# Altium project EmSys_K70Wn_v1.PrjPCB (part 3 of 3)

## Sheet Sheet6.SchDoc
size A3; DocumentNumber: 6; SheetNumber: 6; SheetTotal: 7
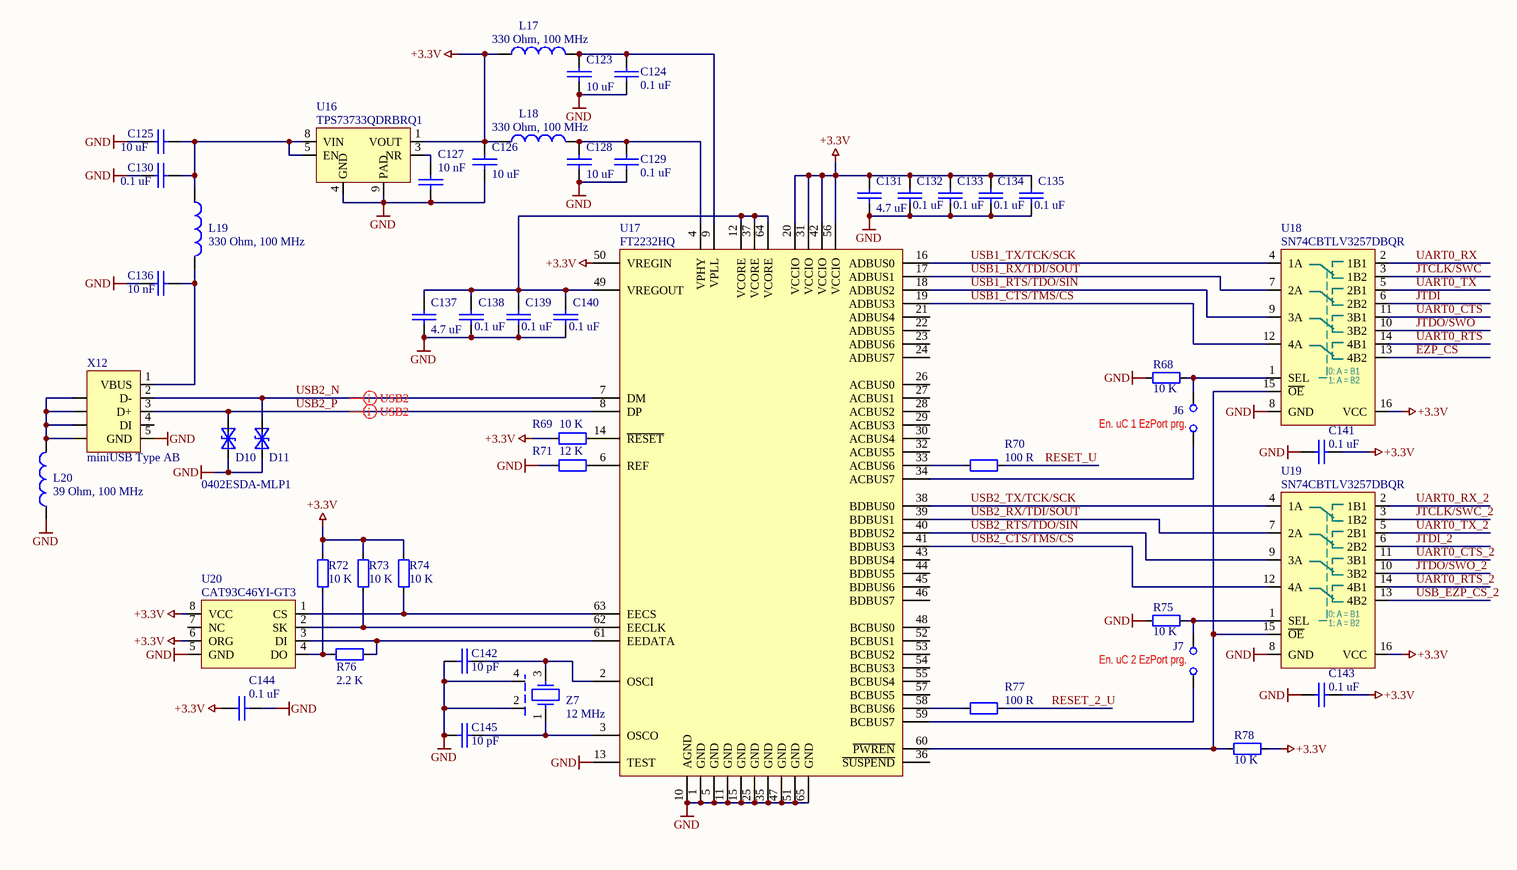
[diagram p5: Sheet6.SchDoc]

### Parts
C123  value 10 uF  [2012[0805]]  (hidden comment: C2012X5R1C106K085AC)
C124  value 0.1 uF  [1005[0402]]  (hidden comment: CL10B104KA8NNND)
C125  value 10 uF  [2012[0805]]  (hidden comment: C2012X5R1C106K085AC)
C126  value 10 uF  [2012[0805]]  (hidden comment: C2012X5R1C106K085AC)
C127  value 10 nF  [1005[0402]]  (hidden comment: CL05B103KB5NNNC)
C128  value 10 uF  [2012[0805]]  (hidden comment: C2012X5R1C106K085AC)
C129  value 0.1 uF  [1005[0402]]  (hidden comment: CL10B104KA8NNND)
C130  value 0.1 uF  [1608[0603]]  (hidden comment: CL10B104KA8NNND)
C131  value 4.7 uF  [1608[0603]]  (hidden comment: LMK107BJ475KA-T)
C132  value 0.1 uF  [1005[0402]]  (hidden comment: CL10B104KA8NNND)
C133  value 0.1 uF  [1005[0402]]  (hidden comment: CL10B104KA8NNND)
C134  value 0.1 uF  [1005[0402]]  (hidden comment: CL10B104KA8NNND)
C135  value 0.1 uF  [1005[0402]]  (hidden comment: CL10B104KA8NNND)
C136  value 10 nF  [1608[0603]]  (hidden comment: CL10B103JB8NNNC)
C137  value 4.7 uF  [1608[0603]]  (hidden comment: LMK107BJ475KA-T)
C138  value 0.1 uF  [1005[0402]]  (hidden comment: CL10B104KA8NNND)
C139  value 0.1 uF  [1005[0402]]  (hidden comment: CL10B104KA8NNND)
C140  value 0.1 uF  [1005[0402]]  (hidden comment: CL10B104KA8NNND)
C141  value 0.1 uF  [1005[0402]]  (hidden comment: CL10B104KA8NNND)
C142  value 10 pF  [1608[0603]]  (hidden comment: CCPF010K0603)
C143  value 0.1 uF  [1005[0402]]  (hidden comment: CL10B104KA8NNND)
C144  value 0.1 uF  [1005[0402]]  (hidden comment: CL10B104KA8NNND)
C145  value 10 pF  [1608[0603]]  (hidden comment: CCPF010K0603)
D10  0402ESDA-MLP1  [0402]  (value not drawn)
D11  0402ESDA-MLP1  [0402]
J6  PH1-02-TA-HT  [HDR1X2V]  (value not drawn)
J7  PH1-02-TA-HT  [HDR1X2V]  (value not drawn)
L17  value 330 Ohm, 100 MHz  [0603]  (hidden comment: BLM18SG331TN1D)
L18  value 330 Ohm, 100 MHz  [0603]  (hidden comment: BLM18SG331TN1D)
L19  value 330 Ohm, 100 MHz  [0603]  (hidden comment: BLM18SG331TN1D)
L20  value 39 Ohm, 100 MHz  [0805]  (hidden comment: EXC-ML20A390U)
R68  value 10 K  [0603]  (hidden comment: ERJ-3EKF1002V)
R69  value 10 K  [0603]  (hidden comment: ERJ-3EKF1002V)
R70  value 100 R  [0603]  (hidden comment: ERJ-3EKF1000V)
R71  value 12 K  [0603]  (hidden comment: RC0603FR-0712KL)
R72  value 10 K  [0603]  (hidden comment: ERJ-3EKF1002V)
R73  value 10 K  [0603]  (hidden comment: ERJ-3EKF1002V)
R74  value 10 K  [0603]  (hidden comment: ERJ-3EKF1002V)
R75  value 10 K  [0603]  (hidden comment: ERJ-3EKF1002V)
R76  value 2.2 K  [0603]  (hidden comment: RC0603FR-072K2L)
R77  value 100 R  [0603]  (hidden comment: ERJ-3EKF1000V)
R78  value 10 K  [0603]  (hidden comment: ERJ-3EKF1002V)
U16  TPS73733QDRBRQ1  [TI DRB (S-PVSON-N8)]
U17  FT2232HQ  [QFN-64]
U18  SN74CBTLV3257DBQR  [TI DBQ 16pin (R-PDSO-G16)]
U19  SN74CBTLV3257DBQR  [TI DBQ 16pin (R-PDSO-G16)]
U20  CAT93C46YI-GT3  [TSSOP-8]
X12  miniUSB Type AB  [USB AB 56579-0576 Molex]
Z7  value 12 MHz  [DSX321G]  (hidden comment: NX3225SA-12.000MHZ-STD-CSR-1)

### Nets
+3.3V: C126.1 C131.2 C132.2 C133.2 C134.2 C135.2 C141.1 C143.1 C144.2 L17.1 L18.1 R69.2 R72.2 R73.2 R74.2 R78.2 U16.1(VOUT) U17.20(VCCIO) U17.31(VCCIO) U17.42(VCCIO) U17.50(VREGIN) U17.56(VCCIO) U18.16(VCC) U19.16(VCC) U20.6(ORG) U20.8(VCC)
GND: C123.2 C124.1 C125.1 C126.2 C127.2 C128.2 C129.1 C130.2 C131.1 C132.1 C133.1 C134.1 C135.1 C136.2 C137.1 C138.1 C139.1 C140.1 C141.2 C142.2 C143.2 C144.1 C145.2 D10.1(C) D11.1(C) L20.1 R68.1 R71.1 R75.1 U16.4(GND) U16.9(PAD) U17.1(GND) U17.5(GND) U17.10(AGND) U17.11(GND) U17.13(TEST) U17.15(GND) U17.25(GND) U17.35(GND) U17.47(GND) U17.51(GND) U17.65(GND) U18.8(GND) U19.8(GND) U20.5(GND) X12.5(GND) Z7.2 Z7.4
EZP_CS: U18.13(4B2)
JTCLK/SWC: U18.3(1B2)
JTCLK/SWC_2: U19.3(1B2)
JTDI: U18.6(2B2)
JTDI_2: U19.6(2B2)
JTDO/SWO: U18.10(3B2)
JTDO/SWO_2: U19.10(3B2)
RESET_2_U: R77.1
RESET_U: R70.1
UART0_CTS: U18.11(3B1)
UART0_CTS_2: U19.11(3B1)
UART0_RTS: U18.14(4B1)
UART0_RTS_2: U19.14(4B1)
UART0_RX: U18.2(1B1)
UART0_RX_2: U19.2(1B1)
UART0_TX: U18.5(2B1)
UART0_TX_2: U19.5(2B1)
USB1_CTS/TMS/CS: U17.19(ADBUS3) U18.12(4A)
USB1_RTS/TDO/SIN: U17.18(ADBUS2) U18.9(3A)
USB1_RX/TDI/SOUT: U17.17(ADBUS1) U18.7(2A)
USB1_TX/TCK/SCK: U17.16(ADBUS0) U18.4(1A)
USB2_CTS/TMS/CS: U17.41(BDBUS3) U19.12(4A)
USB2_N: D11.2(A) U17.7(DM) X12.2(D-)
USB2_P: D10.2(A) U17.8(DP) X12.3(D+)
USB2_RTS/TDO/SIN: U17.40(BDBUS2) U19.9(3A)
USB2_RX/TDI/SOUT: U17.39(BDBUS1) U19.7(2A)
USB2_TX/TCK/SCK: U17.38(BDBUS0) U19.4(1A)
USB_EZP_CS_2: U19.13(4B2)
NetC123_1: C123.1 C124.2 L17.2 U17.9(VPLL)
NetC125_2: C125.2 C130.1 L19.1 U16.5(EN) U16.8(VIN)
NetC127_1: C127.1 U16.3(NR)
NetC128_1: C128.1 C129.2 L18.2 U17.4(VPHY)
NetC136_1: C136.1 L19.2 X12.1(VBUS)
NetC137_2: C137.2 C138.2 C139.2 C140.2 U17.12(VCORE) U17.37(VCORE) U17.49(VREGOUT) U17.64(VCORE)
NetC142_1: C142.1 U17.2(OSCI) Z7.3
NetC145_1: C145.1 U17.3(OSCO) Z7.1
NetJ6_1: J6.1 R68.2 U18.1(SEL)
NetJ6_2: J6.2 U17.34(ACBUS7)
NetJ7_1: J7.1 R75.2 U19.1(SEL)
NetJ7_2: J7.2 U17.59(BCBUS7)
NetL20_2: L20.2 X12.S1(SHLD) X12.S2(SHLD) X12.S3(SHLD) X12.S4(SHLD)
NetR69_1: R69.1 U17.14(~{RESET})
NetR70_2: R70.2 U17.33(ACBUS6)
NetR71_2: R71.2 U17.6(REF)
NetR72_1: R72.1 R76.2 U20.4(DO)
NetR73_1: R73.1 U17.62(EECLK) U20.2(SK)
NetR74_1: R74.1 U17.63(EECS) U20.1(CS)
NetR76_1: R76.1 U17.61(EEDATA) U20.3(DI)
NetR77_2: R77.2 U17.58(BCBUS6)
NetR78_1: R78.1 U17.60(~{PWREN}) U18.15(~{OE}) U19.15(~{OE})

Not connected (* = marked no-connect by the designer): U17 21(ADBUS4) 22(ADBUS5) 23(ADBUS6) 24(ADBUS7) 26(ACBUS0) 27(ACBUS1) 28(ACBUS2) 29(ACBUS3) 30(ACBUS4) 32(ACBUS5) 36(~{SUSPEND}) 43(BDBUS4) 44(BDBUS5) 45(BDBUS6) 46(BDBUS7) 48(BCBUS0) 52(BCBUS1) 53(BCBUS2) 54(BCBUS3) 55(BCBUS4) 57(BCBUS5); U20 7(NC); X12 4(DI)

### Layout directives
differential pair: USB2_N, USB2_P

### Notes on the sheet
- (near J6) En. uC 1 EzPort prg.
- (near J7) En. uC 2 EzPort prg.
- (in symbol SN74CBTLV3257DBQR) 0: A = B1; 1: A = B2

### Library data of the parts
C123 C125 C126 C128 = C2012X5R1C106K/0.85: 10 uF, 16V, X5R, ±10%, 0805; Manufacturer: TDK Corporation; Distributor: Future; Price: 0.0347 Euro; Tolerance: ±10%; PartNum: C2012X5R1C106K085AC; Voltage: 16V; PartName: C2012X5R1C106K085AC; Price50: 0.0347 Euro; Price100: 0.0347 Euro; Price1000: 0.0347 Euro
C124 C129 C132-C135 C138-C141 C143 C144 = GRM155R71C104KA88D: 0.1 uF, 16V, 10%, X7R, 0402; Manufacturer: Murata; PartNum: 490-3261-1-ND; Tolerance: 10%; Distributor: Digi-Key; Price: 0.005$; Voltage: 16 V
C127 = GRM155R71C103KA01D_1: 10 nF, 16V, 10%, X7R, 0402; Manufacturer: SAMSUNG; Tolerance: 10%; Distributor: Future; Price: 0.02$; PartNum: CL05B103KB5NNNC; Voltage: 16 V; PartName: CL05B103KB5NNNC
C130 = CVNF100K0603-25: 0.1 uF, 25V, 10% , X7R,  0603 SMD MLC Capacitor; Manufacturer: SAMSUNG; Tolerance: 10%; Distributor: Future; Price: 0.0026 Euro; Voltage: 25 V; PartNum: CL10B104KA8NNND; PartName: CL10B104KA8NNND; Price50: 0.0026 Euro; Price100: 0.0026 Euro; Price1000: 0.0026 Euro
C131 C137 = LMK107BJ475KA-T: 4.7 uF, 10V, 10%, X5R, 0603; Manufacturer: Taiyo Yuden; PartNum: 587-1441-1-ND; Tolerance: +-10%; Distributor: Digi-Key; Price: 0.23$; PartName: LMK107BJ475KA-T; Voltage: 10 V
C136 = CVNF010K0603: 10 nF, 50V, 5%, X7R, 0603 SMD MLC Capacitor; Manufacturer: SAMSUNG; Tolerance: 5%; Distributor: Future; Price: 0.0045 Euro; PartNum: CL10B103JB8NNNC; Voltage: 50 V; PartName: CL10B103JB8NNNC; Price50: 0.0045 Euro; Price100: 0.0045 Euro; Price1000: 0.0045 Euro
C142 C145 = CCPF010K0603: 10 pF, 50V, 5%, NP0, 0603 SMD MLC Capacitor; Manufacturer: Kemet; PartNum: 399-1049-1-ND; PartName: C0603C100J5GACTU; Tolerance: 5%; Price: 0.0075$; Distributor: Digi-Key; Voltage: 50 V
D10 D11 = 0402ESDA-MLP1: SUPPRESSOR ESD 30VDC 0402 HFREE; Manufacturer: Cooper Bussmann; PartNum: 283-2964-2-ND; Voltage: 30V; Distributor: Digi-Key; Price: 0.087$; PartName: 0402ESDA-MLP1
J6 J7 = Jumper: 2 Pos. 2.54 mm Single Row Through Hole Straight Pin Header; Manufacturer: ADAM TECH; Distributor: Future; Price: 0.02 Euro; PartNum: PH1-02-TA-HT; PartName: PH1-02-TA-HT; Price50: 0.02 Euro; Price100: 0.02 Euro; Price1000: 0.02 Euro
L17-L19 = BLM18SG331TN1D: Ferrite bead, 330 Ohm, 100 MHz,  1.5 A, 0.07 Ohm; Manufacturer: Murata Electronics North America; Tolerance: 25%; Distributor: Future; Price: 0.03 Euro; PartNum: BLM18SG331TN1D; PartName: BLM18SG331TN1D; Price50: 0.03 Euro; Price100: 0.03 Euro; Price1000: 0.03 Euro
L20 = EXC-ML20A390U: Ferrite bead, 39 Ohm, 100 MHz,  4 A; Manufacturer: Panasonic - ECG; PartNum: P10191TR-ND; Ordered: Digi-Key; Distributor: Digi-Key; Price: 0.21$; PartName: EXC-ML20A390U; Price50: 0.17$; Price100: 0.15$; Price1000: 0.1$
R68 R69 R72-R75 R78 = RL0603K010-1: 10 K, 1%, 0603, SMD Resistor, Taped; Manufacturer: PANASONIC; Voltage: 75 V; Distributor: Future; Price: 0.0015 Euro; Tolerance: 1%; PartNum: ERJ-3EKF1002V; PartName: ERJ-3EKF1002V; Price50: 0.0015 Euro; Price100: 0.0015 Euro; Price1000: 0.0015 Euro
R70 R77 = RL0603E100-1: 100 R, 1%, 0603, SMD Resistor, Taped; Manufacturer: PANASONIC; Voltage: 75 V; Distributor: Future; Price: 0.0017$; Tolerance: 1%; PartNum: ERJ-3EKF1000V; PartName: ERJ-3EKF1000V; Price50: 0.0015 Euro; Price100: 0.0015 Euro; Price1000: 0.0015 Euro
R71 = RL0603K012-1_1: 12 K, 1%, 0603, SMD Resistor, Taped; Manufacturer: YAGEO AMERICA CORPORATION; Voltage: 75 V; Distributor: Farnell; Price: 0.0017$; Tolerance: 1%; PartNum: RC0603FR-0712KL; PartName: RC0603FR-0712KL; Price50: 0.0017$; Price100: 0.0017$; Price1000: 0.0017$
R76 = RL0603K002.2-1_1: 2.2 K, 1%, 0603, SMD Resistor, Taped; Manufacturer: YAGEO AMERICA CORPORATION; Voltage: 75 V; Distributor: Future; Price: 0.0017$; Tolerance: 1%; PartNum: RC0603FR-072K2L; PartName: RC0603FR-072K2L; Price50: 0.0017$; Price100: 0.0017$; Price1000: 0.0017$
U16 = TPS73733QDRBRQ1: LDO 3.3V 1A , up to 5.5 V, -40..125C,  8-SON; Manufacturer: Texas Instruments; PartNum: 296-24157-1-ND; Price: 2$; Distributor: Digi-Key; PartName: TPS73733QDRBRQ1
U17 = FT2232HQ: Dual High Speed USB to Multipurpose UART/FIFO; Manufacturer: FTDI, Future Technology Devices International Ltd; PartNum: 768-1024-1-ND; Distributor: Dighi-Key; PartName: FT2232HQ; Price: 6.2$
U18 U19 = SN74CBTLV3257DBQR: LV DUAL FET MUX/DEMUX, 2.3..3.6V,  -40..85 C, 16SSOP; Manufacturer: Texas Instruments; PartNum: 296-9135-1-ND; Price: 0.95$; Distributor: Digi-Key; PartName: SN74CBTLV3257DBQR
U20 = CAT93C46YI-GT3: EEPROM 1KBIT 2MHZ 8TSSOP, -40..85 C; Manufacturer: ON Semiconductor; PartNum: CAT93C46YI-GT3OSCT-ND; Price: 0.4$; Distributor: DigiKey; PartName: CAT93C46YI-GT3
X12 = USB AB 56579-0576: SMD USB - OTG, miniUSB Type AB; Manufacturer: Molex/Waldom Electronics Corp; PartNum: WM17122CT-ND; Ordered: Digi-Key; Distributor: Digi-Key; Price: 2.81$; PartName: miniUSB Type AB; Price50: 2.43$; Price100: 1.83$; Price1000: 1.62$
Z7 = NX3225SA-12.000MHZ-STD-CSR-1: 12 MHz, 8 pF, ±15ppm, -10...+75 С; Manufacturer: NDK; PartNum: 644-1047-1-ND; Price: 1$; Distributor: Digi-Key; Tolerance: 15 ppm; PartName: NX3225SA-12.000MHZ-STD-CSR-1

## Sheet Sheet7.SchDoc
size A3; DocumentNumber: 7; SheetNumber: 7; SheetTotal: 7
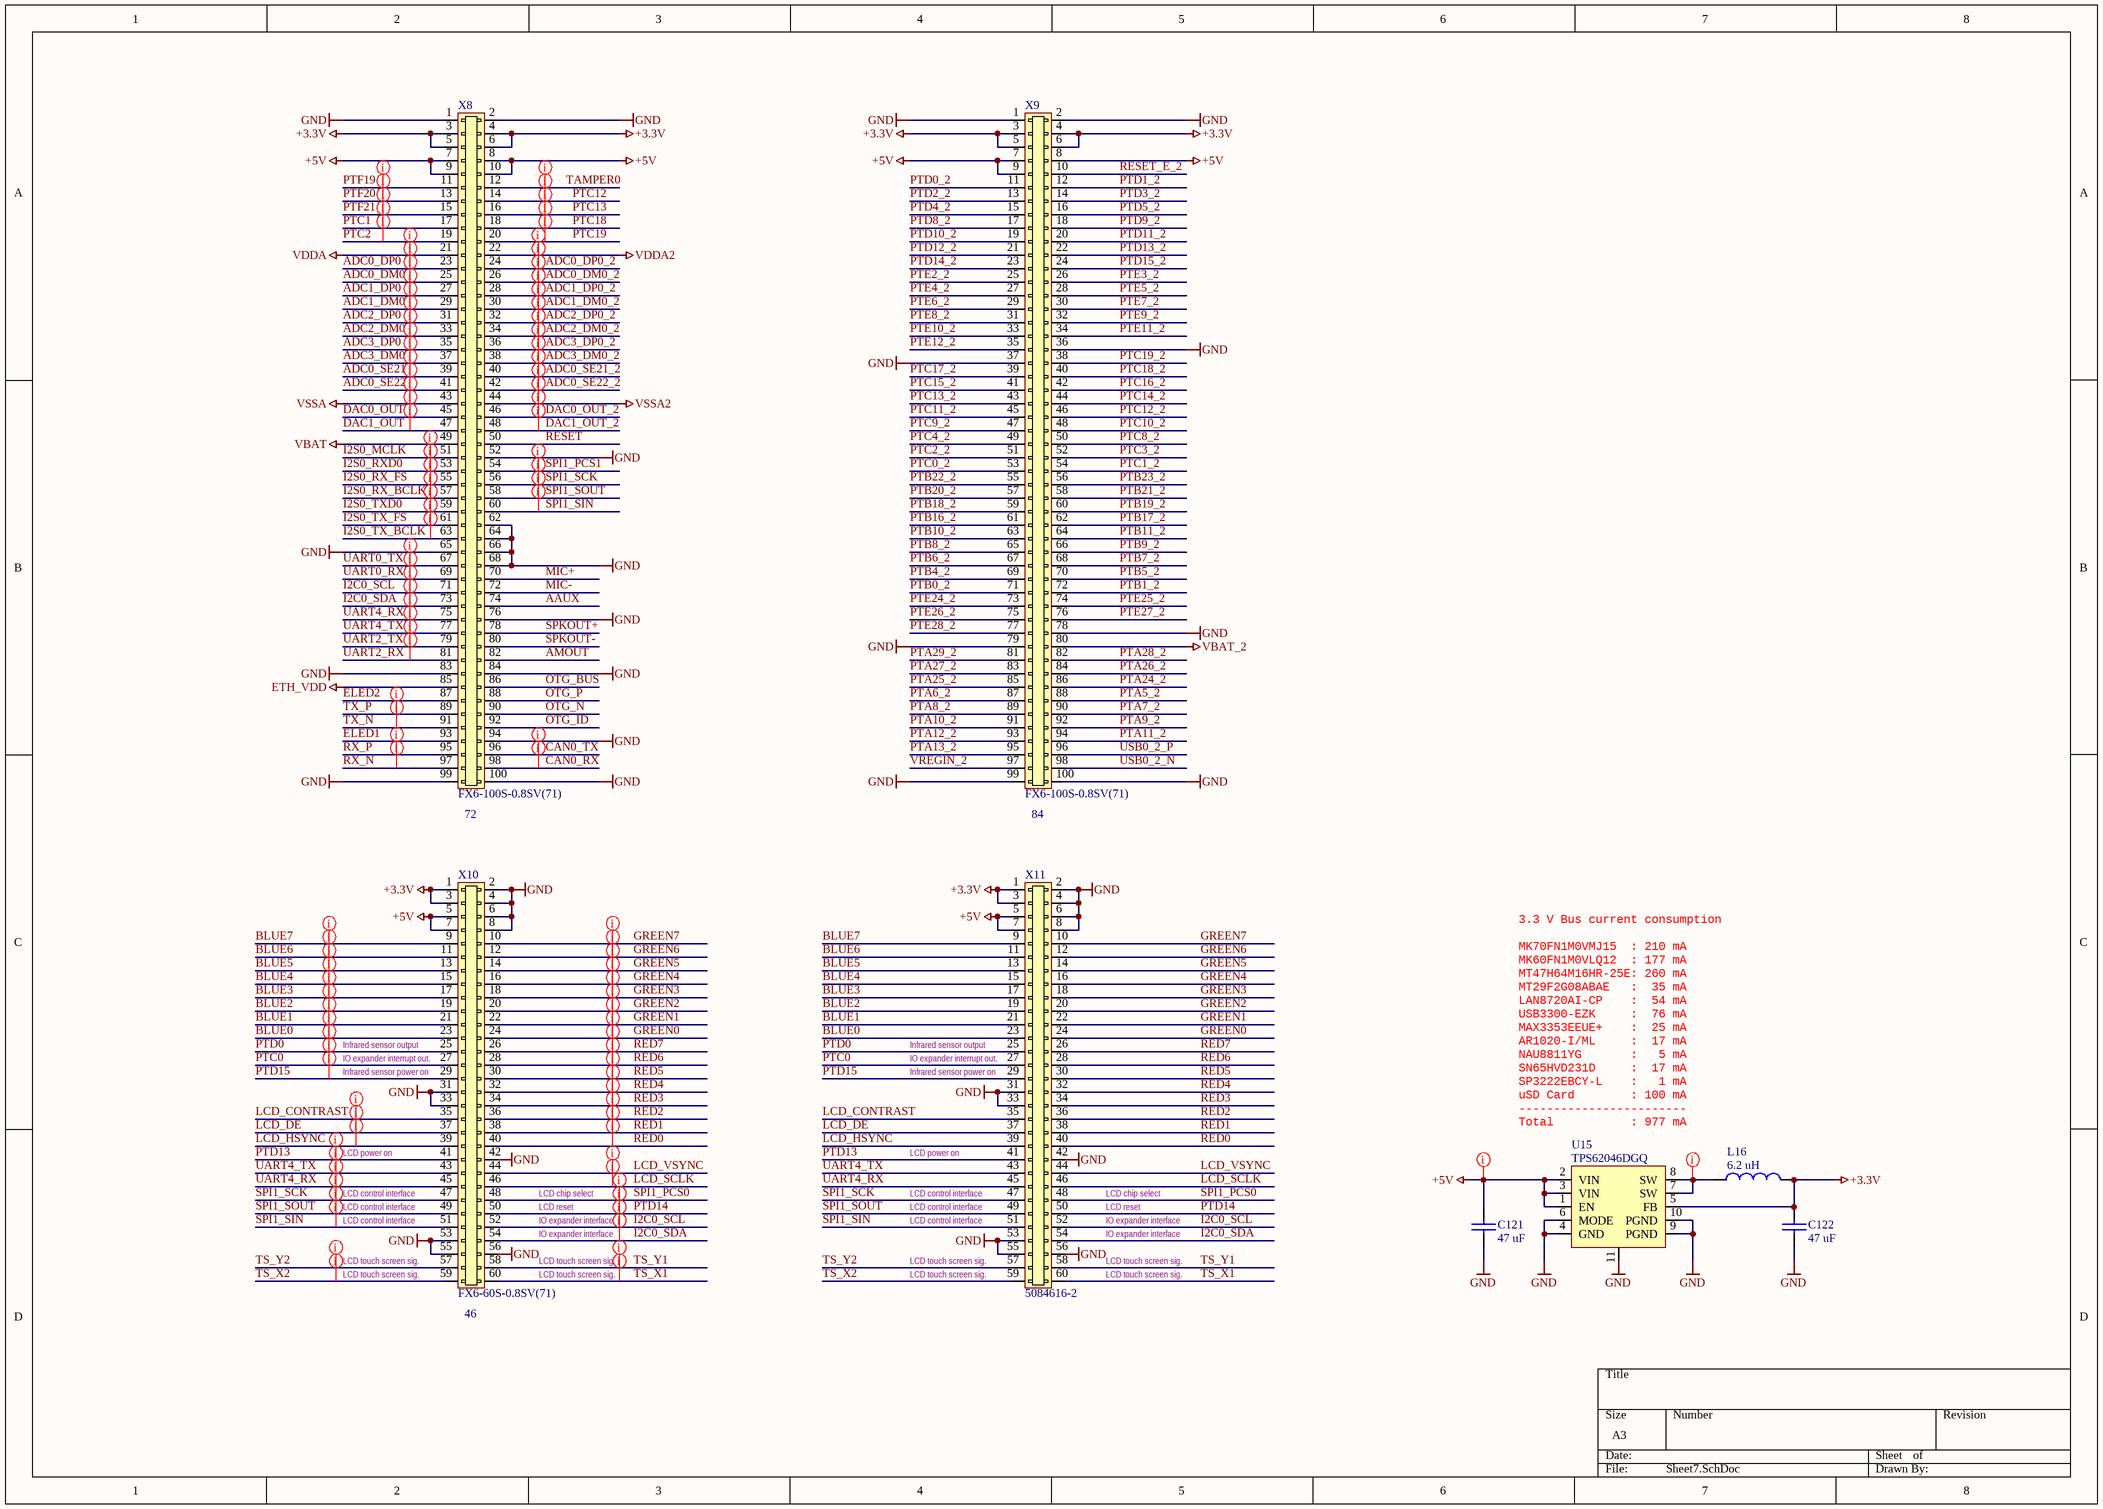
[diagram p6: Sheet7.SchDoc]

### Parts
C121  value 47 uF  [3225[1210]]  (hidden comment: GRM32ER71A476KE15L)
C122  value 47 uF  [3225[1210]]  (hidden comment: GRM32ER71A476KE15L)
L16  value 6.2 uH  [CDRH6D38]  (hidden comment: CDRH6D38NP-6R2NC)
U15  TPS62046DGQ  [TI-DGQ 10pin (R-PDSO-G10)]
X8  FX6-100S-0.8SV(71)  [FX6-100S-0.8SV(71)]
X9  FX6-100S-0.8SV(71)  [FX6-100S-0.8SV(71)]
X10  FX6-60S-0.8SV(71)  [FX6-60S-0.8SV(71)]
X11  5084616-2  [5084616-2]

### Nets
+3.3V: C122.1 L16.2 U15.5(FB) X8.3 X8.4 X8.5 X8.6 X9.3 X9.4 X9.5 X9.6 X10.1 X10.3 X11.1 X11.3
+5V: C121.1 U15.1(EN) U15.2(VIN) U15.3(VIN) X8.7 X8.8 X8.9 X8.10 X9.7 X9.8 X9.9 X10.5 X10.7 X11.5 X11.7
ETH_VDD: X8.85
GND: C121.2 C122.2 U15.4(GND) U15.6(MODE) U15.9(PGND) U15.10(PGND) U15.11(PAD) X8.1 X8.2 X8.52 X8.62 X8.64 X8.65 X8.66 X8.68 X8.76 X8.83 X8.84 X8.94 X8.99 X8.100 X9.1 X9.2 X9.36 X9.37 X9.78 X9.79 X9.99 X9.100 X10.2 X10.4 X10.6 X10.8 X10.31 X10.33 X10.42 X10.53 X10.55 X10.56 X11.2 X11.4 X11.6 X11.8 X11.31 X11.33 X11.42 X11.53 X11.55 X11.56
VBAT: X8.49
VBAT_2: X9.80
VDDA: X8.21
VDDA2: X8.22
VSSA: X8.43
VSSA2: X8.44
AAUX: X8.74
ADC0_DM0: X8.25
ADC0_DM0_2: X8.26
ADC0_DP0: X8.23
ADC0_DP0_2: X8.24
ADC0_SE21: X8.39
ADC0_SE21_2: X8.40
ADC0_SE22: X8.41
ADC0_SE22_2: X8.42
ADC1_DM0: X8.29
ADC1_DM0_2: X8.30
ADC1_DP0: X8.27
ADC1_DP0_2: X8.28
ADC2_DM0: X8.33
ADC2_DM0_2: X8.34
ADC2_DP0: X8.31
ADC2_DP0_2: X8.32
ADC3_DM0: X8.37
ADC3_DM0_2: X8.38
ADC3_DP0: X8.35
ADC3_DP0_2: X8.36
AMOUT: X8.82
BLUE0: X10.23 X11.23
BLUE1: X10.21 X11.21
BLUE2: X10.19 X11.19
BLUE3: X10.17 X11.17
BLUE4: X10.15 X11.15
BLUE5: X10.13 X11.13
BLUE6: X10.11 X11.11
BLUE7: X10.9 X11.9
CAN0_RX: X8.98
CAN0_TX: X8.96
DAC0_OUT: X8.45
DAC0_OUT_2: X8.46
DAC1_OUT: X8.47
DAC1_OUT_2: X8.48
ELED1: X8.93
ELED2: X8.87
GREEN0: X10.24 X11.24
GREEN1: X10.22 X11.22
GREEN2: X10.20 X11.20
GREEN3: X10.18 X11.18
GREEN4: X10.16 X11.16
GREEN5: X10.14 X11.14
GREEN6: X10.12 X11.12
GREEN7: X10.10 X11.10
I2C0_SCL: X8.71 X10.52 X11.52
I2C0_SDA: X8.73 X10.54 X11.54
I2S0_MCLK: X8.51
I2S0_RX_BCLK: X8.57
I2S0_RX_FS: X8.55
I2S0_RXD0: X8.53
I2S0_TX_BCLK: X8.63
I2S0_TX_FS: X8.61
I2S0_TXD0: X8.59
LCD_CONTRAST: X10.35 X11.35
LCD_DE: X10.37 X11.37
LCD_HSYNC: X10.39 X11.39
LCD_SCLK: X10.46 X11.46
LCD_VSYNC: X10.44 X11.44
MIC+: X8.70
MIC-: X8.72
OTG_BUS: X8.86
OTG_ID: X8.92
OTG_N: X8.90
OTG_P: X8.88
PTA5_2: X9.88
PTA6_2: X9.87
PTA7_2: X9.90
PTA8_2: X9.89
PTA9_2: X9.92
PTA10_2: X9.91
PTA11_2: X9.94
PTA12_2: X9.93
PTA13_2: X9.95
PTA24_2: X9.86
PTA25_2: X9.85
PTA26_2: X9.84
PTA27_2: X9.83
PTA28_2: X9.82
PTA29_2: X9.81
PTB0_2: X9.71
PTB1_2: X9.72
PTB4_2: X9.69
PTB5_2: X9.70
PTB6_2: X9.67
PTB7_2: X9.68
PTB8_2: X9.65
PTB9_2: X9.66
PTB10_2: X9.63
PTB11_2: X9.64
PTB16_2: X9.61
PTB17_2: X9.62
PTB18_2: X9.59
PTB19_2: X9.60
PTB20_2: X9.57
PTB21_2: X9.58
PTB22_2: X9.55
PTB23_2: X9.56
PTC0: X10.27 X11.27
PTC0_2: X9.53
PTC1: X8.17
PTC1_2: X9.54
PTC2: X8.19
PTC2_2: X9.51
PTC3_2: X9.52
PTC4_2: X9.49
PTC8_2: X9.50
PTC9_2: X9.47
PTC10_2: X9.48
PTC11_2: X9.45
PTC12: X8.14
PTC12_2: X9.46
PTC13: X8.16
PTC13_2: X9.43
PTC14_2: X9.44
PTC15_2: X9.41
PTC16_2: X9.42
PTC17_2: X9.39
PTC18: X8.18
PTC18_2: X9.40
PTC19: X8.20
PTC19_2: X9.38
PTD0: X10.25 X11.25
PTD0_2: X9.11
PTD1_2: X9.12
PTD2_2: X9.13
PTD3_2: X9.14
PTD4_2: X9.15
PTD5_2: X9.16
PTD8_2: X9.17
PTD9_2: X9.18
PTD10_2: X9.19
PTD11_2: X9.20
PTD12_2: X9.21
PTD13: X10.41 X11.41
PTD13_2: X9.22
PTD14: X10.50 X11.50
PTD14_2: X9.23
PTD15: X10.29 X11.29
PTD15_2: X9.24
PTE2_2: X9.25
PTE3_2: X9.26
PTE4_2: X9.27
PTE5_2: X9.28
PTE6_2: X9.29
PTE7_2: X9.30
PTE8_2: X9.31
PTE9_2: X9.32
PTE10_2: X9.33
PTE11_2: X9.34
PTE12_2: X9.35
PTE24_2: X9.73
PTE25_2: X9.74
PTE26_2: X9.75
PTE27_2: X9.76
PTE28_2: X9.77
PTF19: X8.11
PTF20: X8.13
PTF21: X8.15
RED0: X10.40 X11.40
RED1: X10.38 X11.38
RED2: X10.36 X11.36
RED3: X10.34 X11.34
RED4: X10.32 X11.32
RED5: X10.30 X11.30
RED6: X10.28 X11.28
RED7: X10.26 X11.26
RESET: X8.50
RESET_E_2: X9.10
RX_N: X8.97
RX_P: X8.95
SPI1_PCS0: X10.48 X11.48
SPI1_PCS1: X8.54
SPI1_SCK: X8.56 X10.47 X11.47
SPI1_SIN: X8.60 X10.51 X11.51
SPI1_SOUT: X8.58 X10.49 X11.49
SPKOUT+: X8.78
SPKOUT-: X8.80
TAMPER0: X8.12
TS_X1: X10.60 X11.60
TS_X2: X10.59 X11.59
TS_Y1: X10.58 X11.58
TS_Y2: X10.57 X11.57
TX_N: X8.91
TX_P: X8.89
UART0_RX: X8.69
UART0_TX: X8.67
UART2_RX: X8.81
UART2_TX: X8.79
UART4_RX: X8.75 X10.45 X11.45
UART4_TX: X8.77 X10.43 X11.43
USB0_2_N: X9.98
USB0_2_P: X9.96
VREGIN_2: X9.97
NetL16_1: L16.1 U15.7(SW) U15.8(SW)

### Layout directives
net class LCD: BLUE0, BLUE1, BLUE2, BLUE3, BLUE4, BLUE5, BLUE6, BLUE7, GREEN0, GREEN1, GREEN2, GREEN3, GREEN4, GREEN5, GREEN6, GREEN7, LCD_CONTRAST, LCD_DE, LCD_HSYNC, LCD_SCLK, LCD_VSYNC, RED0, RED1, RED2, RED3, RED4, RED5, RED6, RED7, SPI1_SCK, SPI1_SIN, SPI1_SOUT
net class LCD_MISC: I2C0_SCL, I2C0_SDA, PTC0, PTD0, PTD13, PTD14, PTD15, SPI1_PCS0, TS_X1, TS_X2, TS_Y1, TS_Y2, UART4_RX, UART4_TX
net class GPIO_1: PTC1, PTC2, PTC12, PTC13, PTC18, PTC19, PTF19, PTF20, PTF21, TAMPER0
net class ANALOG1: ADC0_DM0, ADC0_DP0, ADC0_SE21, ADC0_SE22, ADC1_DM0, ADC1_DP0, ADC2_DM0, ADC2_DP0, ADC3_DM0, ADC3_DP0, DAC0_OUT, DAC1_OUT, VDDA, VSSA
net class ANALOG2: ADC0_DM0_2, ADC0_DP0_2, ADC0_SE21_2, ADC0_SE22_2, ADC1_DM0_2, ADC1_DP0_2, ADC2_DM0_2, ADC2_DP0_2, ADC3_DM0_2, ADC3_DP0_2, DAC0_OUT_2, DAC1_OUT_2, VDDA2, VSSA2
net class ETH_TX: TX_N, TX_P
net class ETH_RX: RX_N, RX_P
net class INTF1: CAN0_RX, CAN0_TX, I2C0_SCL, I2C0_SDA, SPI1_PCS1, SPI1_SCK, SPI1_SIN, SPI1_SOUT, UART0_RX, UART0_TX, UART2_RX, UART2_TX, UART4_RX, UART4_TX
net class I2S0_1: I2S0_MCLK, I2S0_RX_BCLK, I2S0_RX_FS, I2S0_RXD0, I2S0_TX_BCLK, I2S0_TX_FS, I2S0_TXD0
net class HV: +5V, NetL16_1

### Notes on the sheet
- (near X8) 72
- (near X9) 84
- (near X10) Infrared sensor output
- (near X11) Infrared sensor output
- (near X10) Infrared sensor power on
- (near X10) IO expander interrupt out.
- (near X11) Infrared sensor power on
- (near X11) IO expander interrupt out.
- 3.3 V Bus current consumption
  MK70FN1M0VMJ15  : 210 mA
  MK60FN1M0VLQ12  : 177 mA
  MT47H64M16HR-25E: 260 mA
  MT29F2G08ABAE   :  35 mA
  LAN8720AI-CP    :  54 mA
  USB3300-EZK     :  76 mA
  MAX3353EEUE+    :  25 mA
  AR1020-I/ML     :  17 mA
  NAU8811YG       :   5 mA
  SN65HVD231D     :  17 mA
  SP3222EBCY-L    :   1 mA
  uSD Card        : 100 mA
  ------------------------
  Total           : 977 mA
- LCD power on
- (near X10) LCD touch screen sig.
- (near X10) LCD control interface
- LCD reset
- LCD touch screen sig.
- LCD chip select
- IO expander interface
- (near X11) LCD touch screen sig.
- (near X11) LCD control interface
- (near X10) 46

### Library data of the parts
C121 C122 = GRM32ER71A476KE15L: 47.0 uF, 10V, 10%, X7R, 1210; Manufacturer: Murata Electronics North America; PartNum: 490-5312-2-ND; Tolerance: 10%; Price: 3.3; Distributor: Digi-Key; Voltage: 10V; PartName: GRM32ER71A476KE15L
L16 = CDRH6D38NP-6R2NC: INDUCTOR POWER 6.2UH 2.50A SMD; Manufacturer: Sumida America Components Inc; PartNum: 308-2315-1-ND; Tolerance: ±30%; Distributor: Digi-Key; Price: 0.71$; PartName: CDRH6D38NP-6R2NC
U15 = TPS62046DGQ: REG BUCK SYNC 3.3V , 2.5..6V, 1.2A, -40..85 C, 10MSOP; Manufacturer: Texas Instruments; PartNum: 296-27023-5-ND; Distributor: Digi-Key; price: 3.1$; PartName: TPS62046DGQ
X8 X9 = FX6-100S-0.8SV(71): RECEPT 100POS .8MM SMD GOLD, 5mm, 6mm, 7 mm; Manufacturer: Hirose Electric Co Ltd; PartNum: H10808-ND; Price: 5.7$; Distributor: Digi-Key; PartName: FX6-100S-0.8SV(71)
X10 = FX6-60S-0.8SV(71): RECEPT 60POS .8MM W/BOSS; Manufacturer: Hirose Electric Co Ltd; PartNum: H10806-ND; Price: 3.7$; Distributor: DigiKey; PartName: FX6-60S-0.8SV(71)
X11 = 5084616-2: Free Height (FH) Connectors 60P 13mm RECEPTACLE STACK HEIGHT 13-16mm; Manufacturer: Tyco Electronics / AMP; PartNum: A99235CT-ND; Ordered: Digi-Key; Price: 6.47$; Distributor: Digi-Key; PartName: 5084616-2; Price50: 5.66$; Price100: 5.39$; Price1000: 2.41$

## Nets that join several sheets
+3.3V: Sheet1 (5 pins), Sheet2 (33 pins), Sheet3 (36 pins), Sheet4 (27 pins), Sheet6 (26 pins), Sheet7 (15 pins)
+5V: Sheet3 (C77.1 U8.17 U11.7), Sheet4 (R60.1), Sheet5 (U21.8), Sheet7 (15 pins)
ETH_VDD: Sheet3 (14 pins), Sheet7 (X8.85)
GND: Sheet1 (11 pins), Sheet2 (105 pins), Sheet3 (87 pins), Sheet4 (36 pins), Sheet5 (81 pins), Sheet6 (48 pins), Sheet7 (49 pins)
USB_VBUS: Sheet2 (R20.2), Sheet3 (6 pins)
VBAT: Sheet2 (D2.2 R22.1 R23.1 U2.P5), Sheet7 (X8.49)
VBAT_2: Sheet2 (R23.2), Sheet4 (U1.42), Sheet7 (X9.80)
VDDA: Sheet2 (5 pins), Sheet7 (X8.21)
VDDA2: Sheet4 (5 pins), Sheet7 (X8.22)
VSSA: Sheet2 (6 pins), Sheet7 (X8.43)
VSSA2: Sheet4 (6 pins), Sheet7 (X8.44)
AAUX: Sheet3 (U8.18), Sheet7 (X8.74)
ADC0_DM0: Sheet1 (U2.R2), Sheet7 (X8.25)
ADC0_DM0_2: Sheet4 (U1.28), Sheet7 (X8.26)
ADC0_DP0: Sheet1 (U2.R1), Sheet7 (X8.23)
ADC0_DP0_2: Sheet4 (U1.27), Sheet7 (X8.24)
ADC0_SE21: Sheet1 (U2.N3), Sheet7 (X8.39)
ADC0_SE21_2: Sheet4 (U1.36), Sheet7 (X8.40)
ADC0_SE22: Sheet1 (U2.P3), Sheet7 (X8.41)
ADC0_SE22_2: Sheet4 (U1.35), Sheet7 (X8.42)
ADC1_DM0: Sheet1 (U2.T2), Sheet7 (X8.29)
ADC1_DM0_2: Sheet4 (U1.30), Sheet7 (X8.30)
ADC1_DP0: Sheet1 (U2.T1), Sheet7 (X8.27)
ADC1_DP0_2: Sheet4 (U1.29), Sheet7 (X8.28)
ADC2_DM0: Sheet1 (U2.N2), Sheet7 (X8.33)
ADC2_DM0_2: Sheet4 (U1.24), Sheet7 (X8.34)
ADC2_DP0: Sheet1 (U2.N1), Sheet7 (X8.31)
ADC2_DP0_2: Sheet4 (U1.23), Sheet7 (X8.32)
ADC3_DM0: Sheet1 (U2.P2), Sheet7 (X8.37)
ADC3_DM0_2: Sheet4 (U1.26), Sheet7 (X8.38)
ADC3_DP0: Sheet1 (U2.P1), Sheet7 (X8.35)
ADC3_DP0_2: Sheet4 (U1.25), Sheet7 (X8.36)
AMOUT: Sheet3 (U8.13), Sheet7 (X8.82)
BLUE0: Sheet1 (U2.L16), Sheet7 (X10.23 X11.23)
BLUE1: Sheet1 (U2.K16), Sheet7 (X10.21 X11.21)
BLUE2: Sheet1 (U2.J16), Sheet7 (X10.19 X11.19)
BLUE3: Sheet1 (U2.F15), Sheet7 (X10.17 X11.17)
BLUE4: Sheet1 (U2.F16), Sheet7 (X10.15 X11.15)
BLUE5: Sheet1 (U2.K12), Sheet7 (X10.13 X11.13)
BLUE6: Sheet1 (U2.L12), Sheet7 (X10.11 X11.11)
BLUE7: Sheet1 (U2.K11), Sheet7 (X10.9 X11.9)
CAN0_RX: Sheet1 (U2.H15), Sheet7 (X8.98)
CAN0_TX: Sheet1 (U2.H14), Sheet7 (X8.96)
DAC0_OUT: Sheet1 (U2.R3), Sheet7 (X8.45)
DAC0_OUT_2: Sheet4 (U1.38), Sheet7 (X8.46)
DAC1_OUT: Sheet1 (U2.R4), Sheet7 (X8.47)
DAC1_OUT_2: Sheet4 (U1.39), Sheet7 (X8.48)
DDR_PWR_ON: Sheet1 (U2.P6), Sheet2 (R28.1)
ECRSDV: Sheet1 (U2.R11), Sheet3 (U7.11)
ELED1: Sheet3 (R35.1 X3.9), Sheet7 (X8.93)
ELED2: Sheet3 (R36.1 X3.12), Sheet7 (X8.87)
ERXD0: Sheet1 (U2.N10), Sheet3 (U7.8)
ERXD1: Sheet1 (U2.M10), Sheet3 (U7.7)
ERXER: Sheet1 (U2.T12), Sheet3 (U7.10)
ETH_RESET: Sheet1 (U2.L14), Sheet3 (U7.15)
ETXD0: Sheet1 (U2.N11), Sheet3 (U7.17)
ETXD1: Sheet1 (U2.T11), Sheet3 (U7.18)
ETXEN: Sheet1 (U2.P11), Sheet3 (U7.16)
EZP_CS: Sheet1 (U2.R8), Sheet6 (U18.13)
EZP_CS_2: Sheet1 (U2.M6), Sheet4 (U14.10)
EZPORT_SEL: Sheet1 (U2.R6), Sheet4 (R61.1 U14.1)
GREEN0: Sheet1 (U2.L11), Sheet7 (X10.24 X11.24)
GREEN1: Sheet1 (U2.H6), Sheet7 (X10.22 X11.22)
GREEN2: Sheet1 (U2.G6), Sheet7 (X10.20 X11.20)
GREEN3: Sheet1 (U2.F6), Sheet7 (X10.18 X11.18)
GREEN4: Sheet1 (U2.E1), Sheet7 (X10.16 X11.16)
GREEN5: Sheet1 (U2.F1), Sheet7 (X10.14 X11.14)
GREEN6: Sheet1 (U2.G1), Sheet7 (X10.12 X11.12)
GREEN7: Sheet1 (U2.M7), Sheet7 (X10.10 X11.10)
I2C0_SCL: Sheet1 (U2.M3), Sheet3 (R56.1 U12.8 U13.5), Sheet7 (X8.71 X10.52 X11.52)
I2C0_SDA: Sheet1 (U2.L4), Sheet3 (R57.1 U12.10 U13.3), Sheet7 (X8.73 X10.54 X11.54)
I2S0_MCLK: Sheet1 (U2.H2), Sheet7 (X8.51)
I2S0_RX_BCLK: Sheet1 (U2.J1), Sheet7 (X8.57)
I2S0_RX_FS: Sheet1 (U2.H4), Sheet7 (X8.55)
I2S0_RXD0: Sheet1 (U2.H3), Sheet3 (U8.6), Sheet7 (X8.53)
I2S0_TX_BCLK: Sheet1 (U2.K3), Sheet3 (U8.9), Sheet7 (X8.63)
I2S0_TX_FS: Sheet1 (U2.K1), Sheet3 (U8.8), Sheet7 (X8.61)
I2S0_TXD0: Sheet1 (U2.J2), Sheet3 (U8.7), Sheet7 (X8.59)
JTCLK/SWC: Sheet1 (R7.1 U2.T7 X1.5), Sheet6 (U18.3)
JTCLK/SWC_2: Sheet4 (R66.1 U14.2 X7.5), Sheet6 (U19.3)
JTDI: Sheet1 (R2.2 U2.N8 X1.3), Sheet6 (U18.6)
JTDI_2: Sheet4 (R62.2 U14.5 X7.3), Sheet6 (U19.6)
JTDO/SWO: Sheet1 (R4.2 U2.T8 X1.7), Sheet6 (U18.10)
JTDO/SWO_2: Sheet4 (R64.2 U1.52 U14.14 X7.7), Sheet6 (U19.10)
LCD_CONTRAST: Sheet1 (U2.G5), Sheet7 (X10.35 X11.35)
LCD_DE: Sheet1 (U2.L13), Sheet7 (X10.37 X11.37)
LCD_HSYNC: Sheet1 (U2.N16), Sheet7 (X10.39 X11.39)
LCD_SCLK: Sheet1 (U2.P16), Sheet7 (X10.46 X11.46)
LCD_VSYNC: Sheet1 (U2.M16), Sheet7 (X10.44 X11.44)
MDC: Sheet1 (U2.M11), Sheet3 (U7.13)
MDIO: Sheet1 (U2.M12), Sheet3 (U7.12)
MIC+: Sheet3 (C69.1 U8.1), Sheet7 (X8.70)
MIC-: Sheet3 (C70.1 U8.20), Sheet7 (X8.72)
NFC_ALE: Sheet1 (U2.F7), Sheet2 (U4.C4)
NFC_CE: Sheet1 (U2.E9), Sheet2 (U4.C6)
NFC_CLE: Sheet1 (U2.J4), Sheet2 (U4.D5)
NFC_D0: Sheet1 (U2.J5), Sheet2 (U4.H4)
NFC_D1: Sheet1 (U2.K5), Sheet2 (U4.J4)
NFC_D2: Sheet1 (U2.G11), Sheet2 (U4.K4)
NFC_D3: Sheet1 (U2.F11), Sheet2 (U4.K5)
NFC_D4: Sheet1 (U2.H12), Sheet2 (U4.K6)
NFC_D5: Sheet1 (U2.G12), Sheet2 (U4.J7)
NFC_D6: Sheet1 (U2.F12), Sheet2 (U4.K7)
NFC_D7: Sheet1 (U2.E15), Sheet2 (U4.J8)
NFC_RDY: Sheet1 (U2.F9), Sheet2 (R21.2 U4.C8)
NFC_RE: Sheet1 (U2.E6), Sheet2 (U4.D4)
NFC_WE: Sheet1 (U2.H11), Sheet2 (U4.C7)
NFC_WP: Sheet1 (U2.F5), Sheet2 (U4.C3)
OTG_BUS: Sheet3 (C102.1 L10.2 X6.1), Sheet7 (X8.86)
OTG_ID: Sheet3 (U13.11 X6.4), Sheet7 (X8.92)
OTG_N: Sheet3 (R55.1 U13.9 X6.2), Sheet7 (X8.90)
OTG_P: Sheet3 (R54.1 U13.10 X6.3), Sheet7 (X8.88)
PTA5_2: Sheet4 (U1.55), Sheet7 (X9.88)
PTA6_2: Sheet4 (U1.58), Sheet7 (X9.87)
PTA7_2: Sheet4 (U1.59), Sheet7 (X9.90)
PTA8_2: Sheet4 (U1.60), Sheet7 (X9.89)
PTA9_2: Sheet4 (U1.61), Sheet7 (X9.92)
PTA10_2: Sheet4 (U1.62), Sheet7 (X9.91)
PTA11_2: Sheet4 (U1.63), Sheet7 (X9.94)
PTA12_2: Sheet4 (U1.64), Sheet7 (X9.93)
PTA13_2: Sheet4 (U1.65), Sheet7 (X9.95)
PTA24_2: Sheet4 (U1.75), Sheet7 (X9.86)
PTA25_2: Sheet4 (U1.76), Sheet7 (X9.85)
PTA26_2: Sheet4 (U1.77), Sheet7 (X9.84)
PTA27_2: Sheet4 (U1.78), Sheet7 (X9.83)
PTA28_2: Sheet4 (U1.79), Sheet7 (X9.82)
PTA29_2: Sheet4 (U1.80), Sheet7 (X9.81)
PTB0_2: Sheet4 (U1.81), Sheet7 (X9.71)
PTB1_2: Sheet4 (U1.82), Sheet7 (X9.72)
PTB4_2: Sheet4 (U1.85), Sheet7 (X9.69)
PTB5_2: Sheet4 (U1.86), Sheet7 (X9.70)
PTB6_2: Sheet4 (U1.87), Sheet7 (X9.67)
PTB7_2: Sheet4 (U1.88), Sheet7 (X9.68)
PTB8_2: Sheet4 (U1.89), Sheet7 (X9.65)
PTB9_2: Sheet4 (U1.90), Sheet7 (X9.66)
PTB10_2: Sheet4 (U1.91), Sheet7 (X9.63)
PTB11_2: Sheet4 (U1.92), Sheet7 (X9.64)
PTB16_2: Sheet4 (U1.95), Sheet7 (X9.61)
PTB17_2: Sheet4 (U1.96), Sheet7 (X9.62)
PTB18_2: Sheet4 (U1.97), Sheet7 (X9.59)
PTB19_2: Sheet4 (U1.98), Sheet7 (X9.60)
PTB20_2: Sheet4 (U1.99), Sheet7 (X9.57)
PTB21_2: Sheet4 (U1.100), Sheet7 (X9.58)
PTB22_2: Sheet4 (U1.101), Sheet7 (X9.55)
PTB23_2: Sheet4 (U1.102), Sheet7 (X9.56)
PTC0: Sheet1 (U2.G16), Sheet7 (X10.27 X11.27)
PTC0_2: Sheet4 (U1.103), Sheet7 (X9.53)
PTC1: Sheet1 (U2.F13), Sheet7 (X8.17)
PTC1_2: Sheet4 (U1.104), Sheet7 (X9.54)
PTC2: Sheet1 (U2.F14), Sheet7 (X8.19)
PTC2_2: Sheet4 (U1.105), Sheet7 (X9.51)
PTC3_2: Sheet4 (U1.106), Sheet7 (X9.52)
PTC4_2: Sheet4 (U1.109), Sheet7 (X9.49)
PTC8_2: Sheet4 (U1.113), Sheet7 (X9.50)
PTC9_2: Sheet4 (U1.114), Sheet7 (X9.47)
PTC10_2: Sheet4 (U1.115), Sheet7 (X9.48)
PTC11_2: Sheet4 (U1.116), Sheet7 (X9.45)
PTC12: Sheet1 (U2.J12), Sheet7 (X8.14)
PTC12_2: Sheet4 (U1.117), Sheet7 (X9.46)
PTC13: Sheet1 (U2.K13), Sheet7 (X8.16)
PTC13_2: Sheet4 (U1.118), Sheet7 (X9.43)
PTC14_2: Sheet4 (U1.119), Sheet7 (X9.44)
PTC15_2: Sheet4 (U1.120), Sheet7 (X9.41)
PTC16_2: Sheet4 (U1.123), Sheet7 (X9.42)
PTC17_2: Sheet4 (U1.124), Sheet7 (X9.39)
PTC18: Sheet1 (U2.M9), Sheet7 (X8.18)
PTC18_2: Sheet4 (U1.125), Sheet7 (X9.40)
PTC19: Sheet1 (U2.M8), Sheet7 (X8.20)
PTC19_2: Sheet4 (U1.126), Sheet7 (X9.38)
PTD0: Sheet1 (U2.L8), Sheet7 (X10.25 X11.25)
PTD0_2: Sheet4 (U1.127), Sheet7 (X9.11)
PTD1_2: Sheet4 (U1.128), Sheet7 (X9.12)
PTD2_2: Sheet4 (U1.129), Sheet7 (X9.13)
PTD3_2: Sheet4 (U1.130), Sheet7 (X9.14)
PTD4_2: Sheet4 (U1.131), Sheet7 (X9.15)
PTD5_2: Sheet4 (U1.132), Sheet7 (X9.16)
PTD8_2: Sheet4 (U1.137), Sheet7 (X9.17)
PTD9_2: Sheet4 (U1.138), Sheet7 (X9.18)
PTD10_2: Sheet4 (U1.139), Sheet7 (X9.19)
PTD11_2: Sheet4 (U1.140), Sheet7 (X9.20)
PTD12_2: Sheet4 (U1.141), Sheet7 (X9.21)
PTD13: Sheet1 (U2.F4), Sheet7 (X10.41 X11.41)
PTD13_2: Sheet4 (U1.142), Sheet7 (X9.22)
PTD14: Sheet1 (U2.E5), Sheet7 (X10.50 X11.50)
PTD14_2: Sheet4 (U1.143), Sheet7 (X9.23)
PTD15: Sheet1 (U2.E4), Sheet7 (X10.29 X11.29)
PTD15_2: Sheet4 (U1.144), Sheet7 (X9.24)
PTE2_2: Sheet4 (U1.3), Sheet7 (X9.25)
PTE3_2: Sheet4 (U1.4), Sheet7 (X9.26)
PTE4_2: Sheet4 (U1.7), Sheet7 (X9.27)
PTE5_2: Sheet4 (U1.8), Sheet7 (X9.28)
PTE6_2: Sheet4 (U1.9), Sheet7 (X9.29)
PTE7_2: Sheet4 (U1.10), Sheet7 (X9.30)
PTE8_2: Sheet4 (U1.11), Sheet7 (X9.31)
PTE9_2: Sheet4 (U1.12), Sheet7 (X9.32)
PTE10_2: Sheet4 (U1.13), Sheet7 (X9.33)
PTE11_2: Sheet4 (U1.14), Sheet7 (X9.34)
PTE12_2: Sheet4 (U1.15), Sheet7 (X9.35)
PTE24_2: Sheet4 (U1.45), Sheet7 (X9.73)
PTE25_2: Sheet4 (U1.46), Sheet7 (X9.74)
PTE26_2: Sheet4 (U1.47), Sheet7 (X9.75)
PTE27_2: Sheet4 (U1.48), Sheet7 (X9.76)
PTE28_2: Sheet4 (U1.49), Sheet7 (X9.77)
PTF19: Sheet1 (U2.H1), Sheet7 (X8.11)
PTF20: Sheet1 (U2.H5), Sheet7 (X8.13)
PTF21: Sheet1 (U2.P9), Sheet7 (X8.15)
RED0: Sheet1 (U2.K7), Sheet7 (X10.40 X11.40)
RED1: Sheet1 (U2.L7), Sheet7 (X10.38 X11.38)
RED2: Sheet1 (U2.N9), Sheet7 (X10.36 X11.36)
RED3: Sheet1 (U2.P10), Sheet7 (X10.34 X11.34)
RED4: Sheet1 (U2.R10), Sheet7 (X10.32 X11.32)
RED5: Sheet1 (U2.R9), Sheet7 (X10.30 X11.30)
RED6: Sheet1 (U2.T9), Sheet7 (X10.28 X11.28)
RED7: Sheet1 (U2.T10), Sheet7 (X10.26 X11.26)
REF50MHZ: Sheet1 (U2.T15), Sheet3 (U7.14)
RESET: Sheet1 (C5.1 D1.3 R6.2 U2.R16), Sheet7 (X8.50)
RESET_2_C: Sheet1 (U2.N6), Sheet4 (D9.1)
RESET_2_U: Sheet4 (D9.2), Sheet6 (R77.1)
RESET_E_2: Sheet4 (D12.2), Sheet7 (X9.10)
RESET_U: Sheet1 (D1.2), Sheet6 (R70.1)
RX_N: Sheet3 (R31.1 U7.22 X3.6), Sheet7 (X8.97)
RX_P: Sheet3 (R32.1 U7.23 X3.3), Sheet7 (X8.95)
SD_CLK: Sheet1 (U2.F3), Sheet3 (X2.5)
SD_CMD: Sheet1 (U2.G2), Sheet3 (X2.3)
SD_D0: Sheet1 (U2.F2), Sheet3 (X2.7)
SD_D1: Sheet1 (U2.E2), Sheet3 (X2.8)
SD_D2: Sheet1 (U2.G4), Sheet3 (X2.1)
SD_D3: Sheet1 (U2.G3), Sheet3 (X2.2)
SPI0_CLK: Sheet1 (U2.F8), Sheet4 (U1.110 U14.3)
SPI0_SIN: Sheet1 (U2.J6), Sheet4 (U14.12)
SPI0_SOUT: Sheet1 (U2.K6), Sheet4 (U1.112 U14.6)
SPI1_PCS0: Sheet1 (U2.J13), Sheet7 (X10.48 X11.48)
SPI1_PCS1: Sheet1 (U2.K15), Sheet3 (U8.10), Sheet7 (X8.54)
SPI1_SCK: Sheet1 (U2.J14), Sheet3 (U8.11), Sheet7 (X8.56 X10.47 X11.47)
SPI1_SIN: Sheet1 (U2.H13), Sheet7 (X8.60 X10.51 X11.51)
SPI1_SOUT: Sheet1 (U2.J15), Sheet3 (U8.12), Sheet7 (X8.58 X10.49 X11.49)
SPI2_PCS0: Sheet1 (U2.G13), Sheet5 (U23.J1 X14.5)
SPI2_SCK: Sheet1 (U2.G14), Sheet5 (U23.E1 X14.4)
SPI2_SIN: Sheet1 (U2.H16), Sheet5 (U23.H1 X14.2)
SPI2_SOUT: Sheet1 (U2.G15), Sheet5 (U23.D1 X14.1)
SPKOUT+: Sheet3 (U8.14), Sheet7 (X8.78)
SPKOUT-: Sheet3 (U8.16), Sheet7 (X8.80)
TAMPER0: Sheet1 (U2.M5), Sheet7 (X8.12)
TS_X1: Sheet3 (D6.1 U12.15), Sheet7 (X10.60 X11.60)
TS_X2: Sheet3 (D8.1 R52.2 U12.16), Sheet7 (X10.59 X11.59)
TS_Y1: Sheet3 (D5.1 U12.12), Sheet7 (X10.58 X11.58)
TS_Y2: Sheet3 (D7.1 U12.13), Sheet7 (X10.57 X11.57)
TX_N: Sheet3 (R33.2 U7.20 X3.2), Sheet7 (X8.91)
TX_P: Sheet3 (R34.2 U7.21 X3.1), Sheet7 (X8.89)
UART0_CTS: Sheet1 (U2.M14), Sheet4 (U1.84), Sheet6 (U18.11)
UART0_CTS_2: Sheet4 (U1.68), Sheet6 (U19.11)
UART0_RTS: Sheet1 (U2.P15), Sheet4 (U1.83), Sheet6 (U18.14)
UART0_RTS_2: Sheet4 (U1.69), Sheet6 (U19.14)
UART0_RX: Sheet1 (U2.K4), Sheet4 (U1.133), Sheet6 (U18.2), Sheet7 (X8.69)
UART0_RX_2: Sheet4 (U1.67), Sheet6 (U19.2)
UART0_TX: Sheet1 (U2.E7), Sheet4 (U1.136), Sheet6 (U18.5), Sheet7 (X8.67)
UART0_TX_2: Sheet4 (U1.66), Sheet6 (U19.5)
UART1_RX: Sheet1 (U2.E13), Sheet4 (U1.1)
UART1_TX: Sheet1 (U2.E14), Sheet4 (U1.2)
UART2_RX: Sheet1 (U2.K2), Sheet7 (X8.81)
UART2_TX: Sheet1 (U2.J3), Sheet7 (X8.79)
UART4_RX: Sheet1 (U2.J11), Sheet7 (X8.75 X10.45 X11.45)
UART4_TX: Sheet1 (U2.F10), Sheet7 (X8.77 X10.43 X11.43)
ULPI_CLK: Sheet1 (U2.R12), Sheet3 (U10.14)
ULPI_DATA0: Sheet1 (U2.P13), Sheet3 (U10.24)
ULPI_DATA1: Sheet1 (U2.R13), Sheet3 (U10.23)
ULPI_DATA2: Sheet1 (U2.N13), Sheet3 (U10.22)
ULPI_DATA3: Sheet1 (U2.R14), Sheet3 (U10.21)
ULPI_DATA4: Sheet1 (U2.M13), Sheet3 (U10.20)
ULPI_DATA5: Sheet1 (U2.R15), Sheet3 (U10.19)
ULPI_DATA6: Sheet1 (U2.P14), Sheet3 (U10.18)
ULPI_DATA7: Sheet1 (U2.N14), Sheet3 (U10.17)
ULPI_DIR: Sheet1 (U2.P12), Sheet3 (U10.12)
ULPI_NXT: Sheet1 (U2.N12), Sheet3 (U10.11)
ULPI_RESET: Sheet1 (U2.T16), Sheet3 (U10.9)
ULPI_STP: Sheet1 (U2.T13), Sheet3 (U10.13)
USB0_2_N: Sheet4 (U1.20), Sheet7 (X9.98)
USB0_2_P: Sheet4 (U1.19), Sheet7 (X9.96)
USB1_N: Sheet1 (U2.M2), Sheet3 (R55.2)
USB1_P: Sheet1 (U2.M1), Sheet3 (R54.2)
USB_EZP_CS_2: Sheet4 (U14.11), Sheet6 (U19.13)
USB_FLG: Sheet1 (U2.K14), Sheet3 (U11.3)
USB_ID_OUT: Sheet1 (U2.M15), Sheet3 (U13.7)
USB_INT: Sheet1 (U2.N15), Sheet3 (U13.6)
VREGIN_2: Sheet4 (R60.2 U1.22), Sheet7 (X9.97)
WIFI_INT: Sheet1 (U2.L15), Sheet5 (U23.G1 X14.3)
WIFI_PWR_EN: Sheet1 (U2.L5), Sheet5 (R79.1 U21.5)
WIFI_PWR_ON: Sheet1 (U2.R5), Sheet5 (U23.T11 X14.6)

## Assembly variants
Full: all parts fitted
Evalution batch: not fitted MIC1 X3 X10